# Altium schematic sheet PG21_ Revision History.SchDoc
size 420 x 297 mm
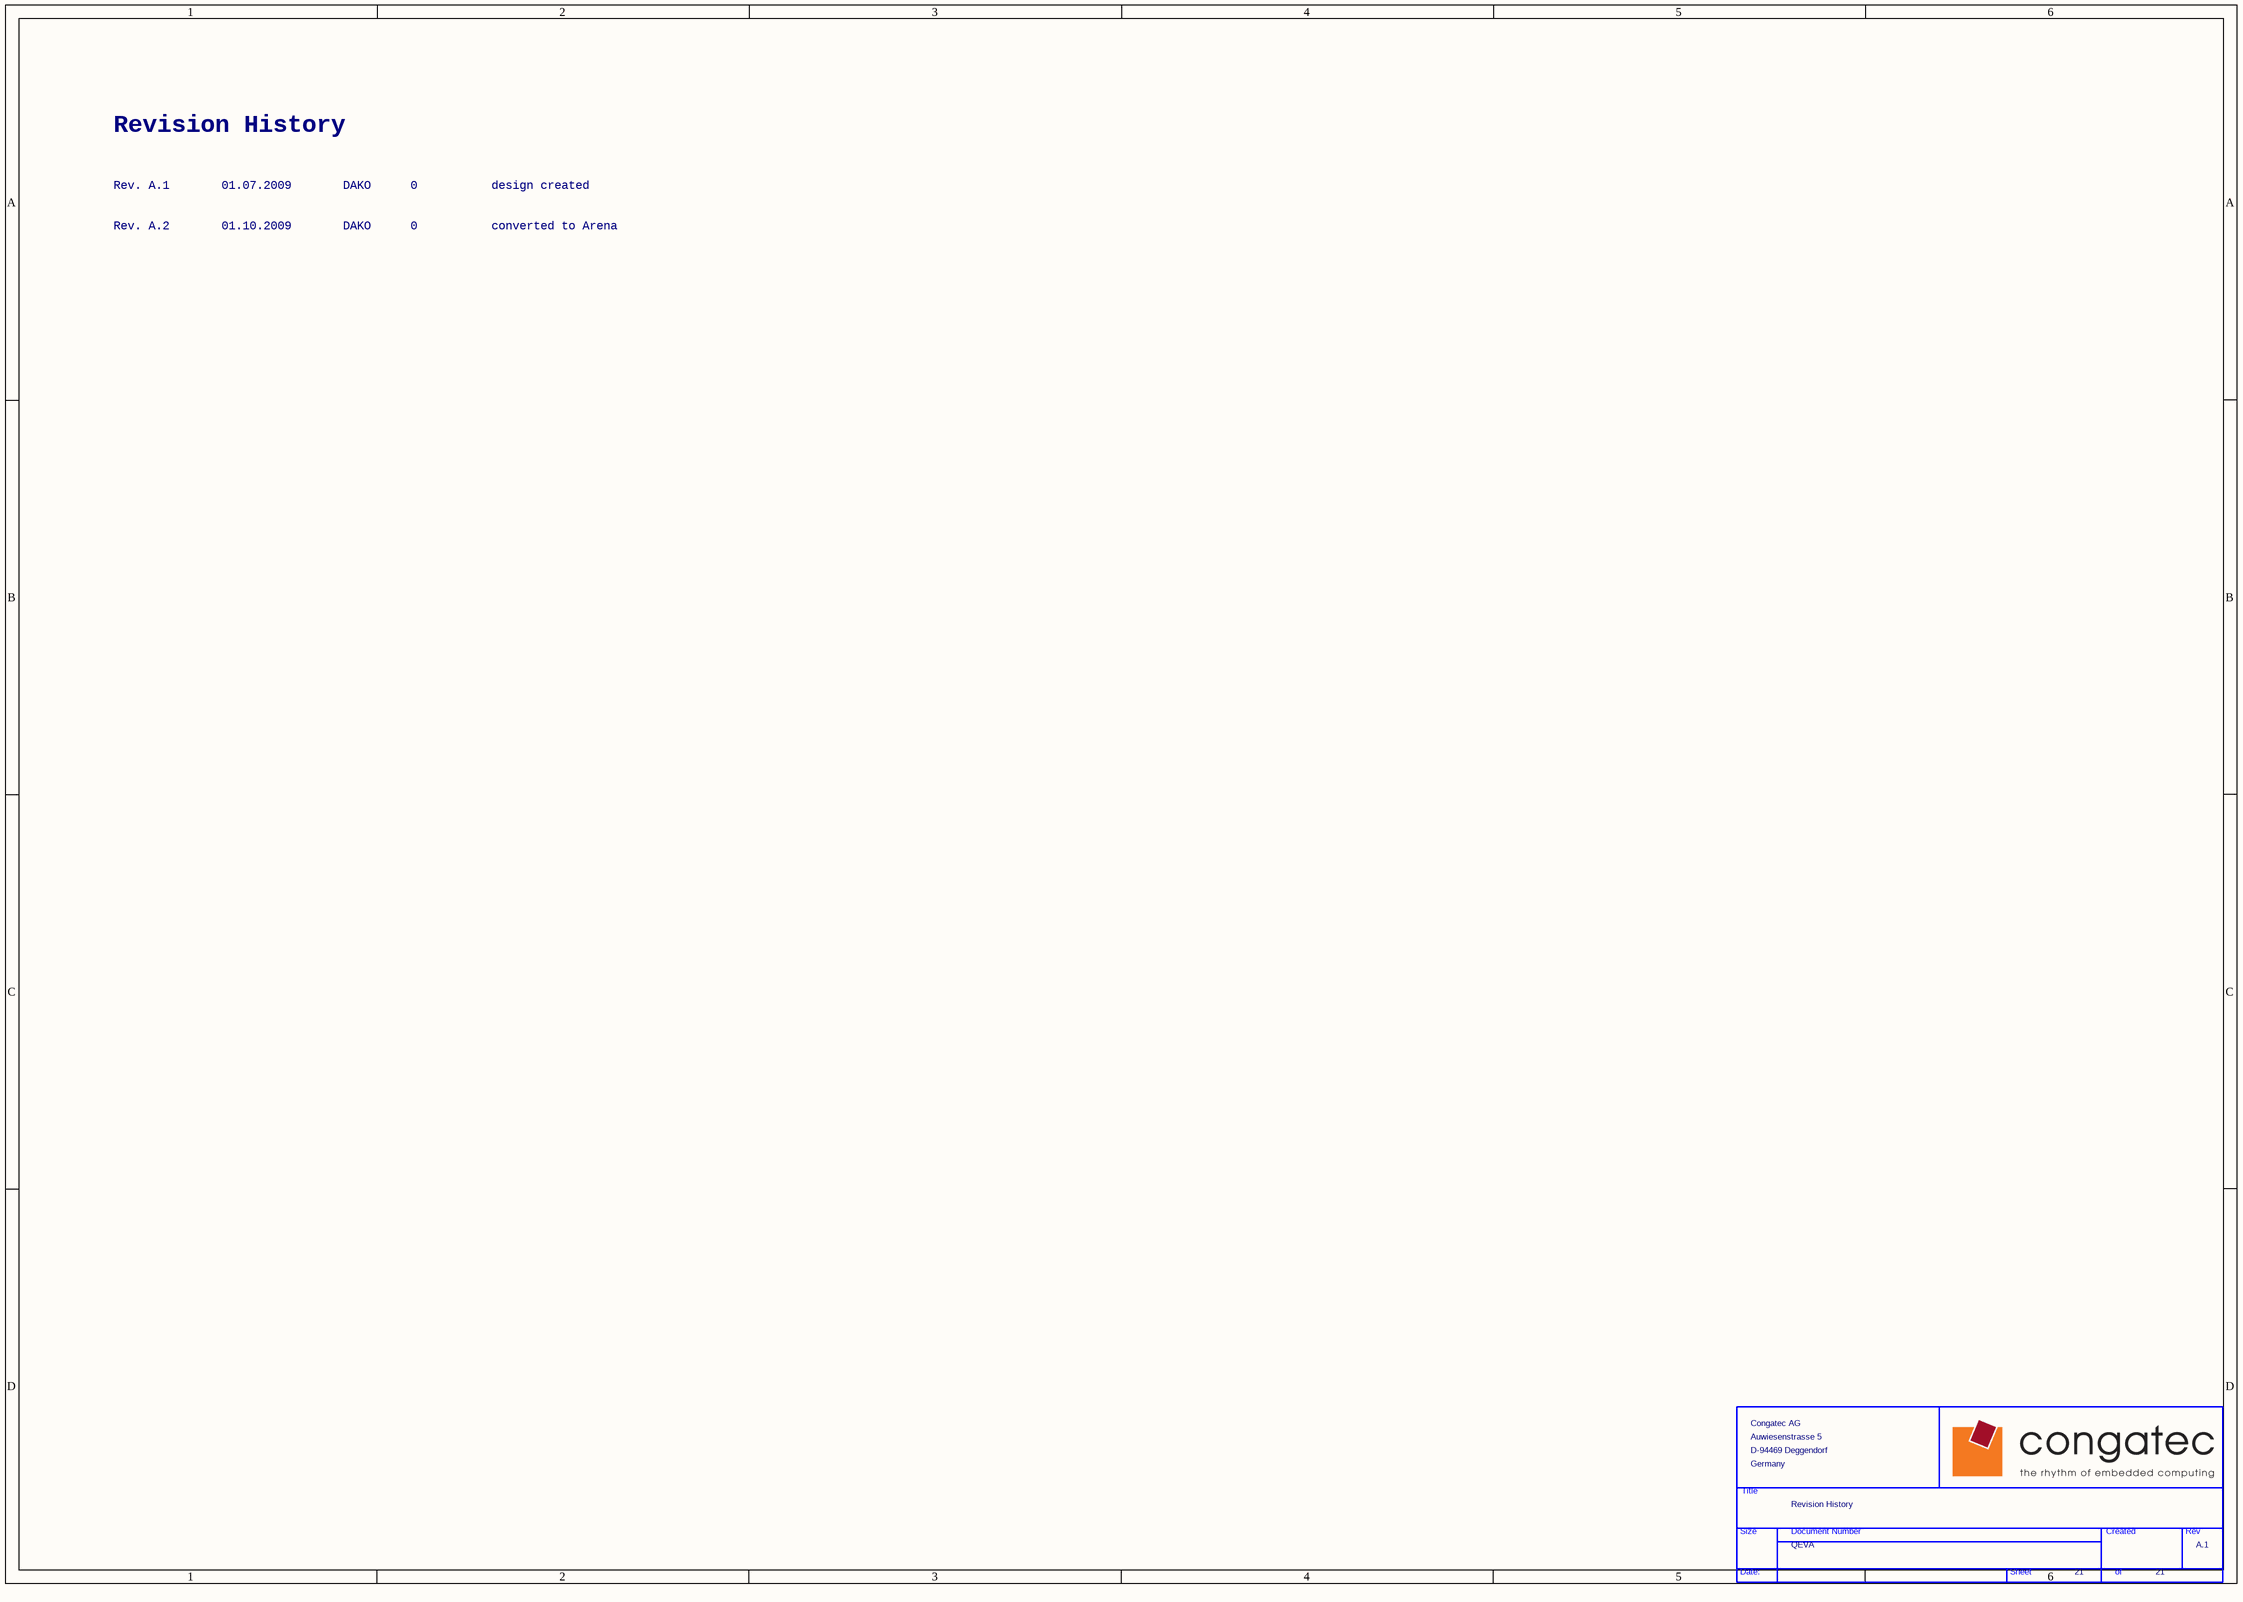
[diagram p0: PG21_ Revision History.SchDoc]

## Parts
*  Page Count: 21  Title: Revision History  RevCode: A.1  Doc: QEVA  OrgName: Congatec AG  OrgAddr1: Auwiesenstrasse 5  OrgAddr2: D-94469 Deggendorf  OrgAddr3: Germany  (hidden comment: TitleBlock_CONGA)  (graphical)

## Notes on the sheet
- Revision History
- Rev. A.1
- 01.07.2009
- DAKO
- 0
- design created
- Rev. A.2
- 01.10.2009
- converted to Arena
- (in symbol TitleBlock_CONGA) Title; Size; Document Number; Created; Rev; Date:; Sheet; of

## Library data of the parts
* = TitleBlock_CONGA: Page Number: 21; Page Create Date: March  8, 1995